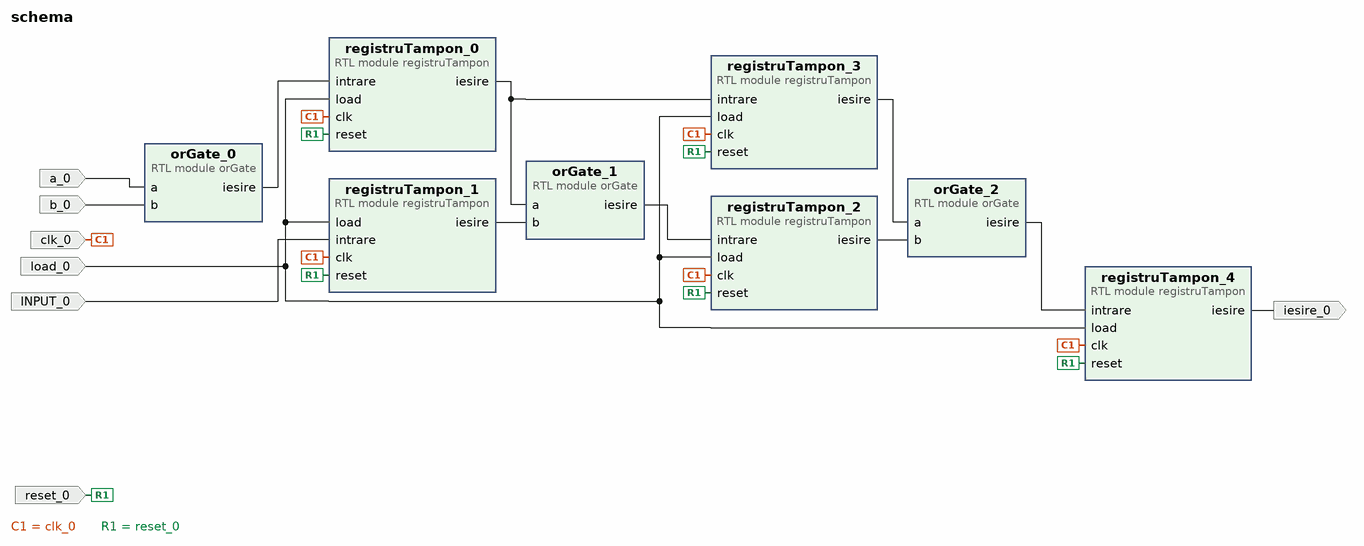
[diagram p0: block diagram of the top level]
# Vivado block design schema, xc7a100tcsg324-1, Vivado 2020.2
create_bd_design schema

create_bd_port -dir I a_0
create_bd_port -dir I b_0
create_bd_port -dir I INPUT_0
create_bd_port -dir I -type clk clk_0
create_bd_port -dir I load_0
create_bd_port -dir I -type rst reset_0
create_bd_port -dir O iesire_0

create_bd_cell -type module -reference registruTampon registruTampon_0
create_bd_cell -type module -reference registruTampon registruTampon_1
create_bd_cell -type module -reference registruTampon registruTampon_2
create_bd_cell -type module -reference registruTampon registruTampon_3
create_bd_cell -type module -reference registruTampon registruTampon_4
create_bd_cell -type module -reference orGate orGate_0
create_bd_cell -type module -reference orGate orGate_1
create_bd_cell -type module -reference orGate orGate_2

# ---- connections ----

connect_bd_net [get_bd_pins orGate_0/iesire] [get_bd_pins registruTampon_0/intrare]
connect_bd_net -net a_0_1 [get_bd_ports a_0] [get_bd_pins orGate_0/a]
connect_bd_net -net b_0_1 [get_bd_ports b_0] [get_bd_pins orGate_0/b]
connect_bd_net -net INPUT_0_1 [get_bd_ports INPUT_0] [get_bd_pins registruTampon_1/intrare]
connect_bd_net -net clk_0_1 [get_bd_ports clk_0] \
  [get_bd_pins registruTampon_0/clk] [get_bd_pins registruTampon_1/clk] [get_bd_pins registruTampon_2/clk] \
  [get_bd_pins registruTampon_3/clk] [get_bd_pins registruTampon_4/clk]
connect_bd_net -net load_0_1 [get_bd_ports load_0] \
  [get_bd_pins registruTampon_0/load] [get_bd_pins registruTampon_1/load] [get_bd_pins registruTampon_2/load] \
  [get_bd_pins registruTampon_3/load] [get_bd_pins registruTampon_4/load]
connect_bd_net -net reset_0_1 [get_bd_ports reset_0] \
  [get_bd_pins registruTampon_0/reset] [get_bd_pins registruTampon_1/reset] [get_bd_pins registruTampon_2/reset] \
  [get_bd_pins registruTampon_3/reset] [get_bd_pins registruTampon_4/reset]
connect_bd_net [get_bd_pins registruTampon_1/iesire] [get_bd_pins orGate_1/b]
connect_bd_net [get_bd_pins registruTampon_0/iesire] [get_bd_pins registruTampon_3/intrare] [get_bd_pins orGate_1/a]
connect_bd_net [get_bd_pins orGate_1/iesire] [get_bd_pins registruTampon_2/intrare]
connect_bd_net [get_bd_pins registruTampon_2/iesire] [get_bd_pins orGate_2/b]
connect_bd_net [get_bd_pins registruTampon_3/iesire] [get_bd_pins orGate_2/a]
connect_bd_net [get_bd_pins orGate_2/iesire] [get_bd_pins registruTampon_4/intrare]
connect_bd_net [get_bd_pins registruTampon_4/iesire] [get_bd_ports iesire_0]

validate_bd_design
save_bd_design
